# EAGLE schematic motor_tb (EAGLE 7.7.0)
AUTHOR: Uros Platise; TITLE: Test Bench for Motor Force Controller
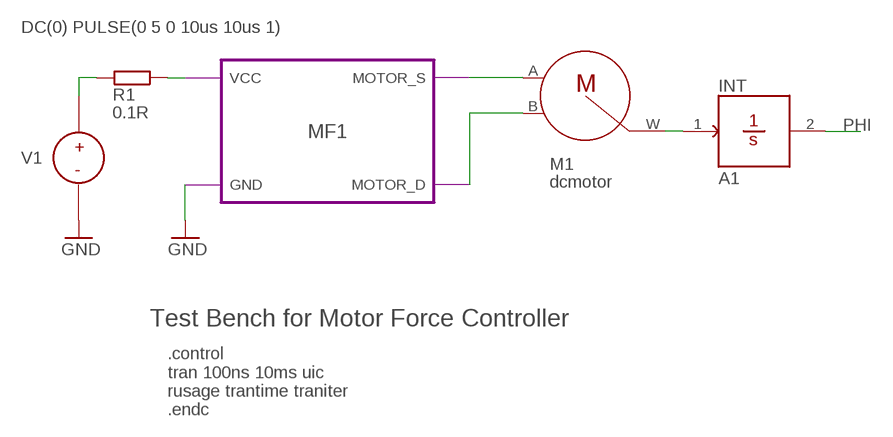
[diagram p0: schematic, sheet 1]

## Parts
A1  INT  [SPICE2]
M1  dcmotor  DCMOTOR  [DCMOTOR]
R1  0.1R  R-EU_R0402  [R0402]
V1  DC(0) PULSE(0 5 0 10us 10us 1)  VSOURCE  [VSOURCE]

## Module instances
MF1 = MOTORFORCE

## Nets
A: M1.A ; port MF1.MOTOR_S
B: M1.B ; port MF1.MOTOR_D
GND: V1.2 ; port MF1.GND
PHI: A1.2(AOUT)
SUP: R1.2 V1.1
VCC: R1.1 ; port MF1.VCC
W: A1.1(AIN) M1.W

## Notes on the sheet
- .control
  tran 100ns 10ms uic
  rusage trantime traniter
  .endc

## Library data of the parts
A1 = ngspice:INT: The Integrator block is a simple integration stage that approximates the integral with respect to time of an input signal. The block also includes gain and input offset parameters to allow for tailoring of the required signal, and output upper and lower limits to prevent convergence errors resulting from excessively large output values. Note that these limits specify integrator behavior similar to that found in an operational amplifierbased integration stage, in that once a limit is reached, additional storage does not occur. Thus, the input of a negative value to an integrator which is currently driving at the out upper limit level will immediately cause a drop in the output, regardless of how long the integrator was previously summing positive inputs. The incremental value of output below the output upper limit and above the output lower limit at which smoothing begins is specified via the limit range parameter. In AC analysis, the value returned is equal to the gain divided by the radian frequency of analysis. Note that truncation error checking is included in the “int” block. This should provide for a more accurate simulation of the time integration function, since the model will inherently request smaller time increments between simulation points if truncation errors would otherwise be excessive.; SPICE_MODEL: .model >VALUE int(in_offset gain out_lower_limit out_upper_limit limit_range out_ic); SP_GAIN: 1; SP_IN_OFFSET: 0; SP_LIMIT_RANGE: 1e-6; SP_OUT_IC: 0; SP_OUT_LOWER_LIMIT: -1e12; SP_OUT_UPPER_LIMIT: 1e12
M1 = ngspice:DCMOTOR: DC Motor; SPICE_DEVICE: X
R1 = rcl_ipc:R-EU_
V1 = ngspice:VSOURCE

## Module MOTORFORCE
Ports: MOTOR_S(out) MOTOR_D(in) VCC(pwr) GND(pwr)
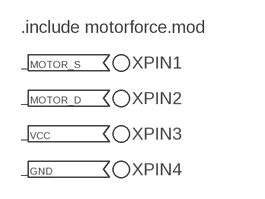
[diagram p1: schematic, module MOTORFORCE, sheet 1]

### Notes on the sheet
- .include motorforce.mod

### Library data of the parts